# EAGLE design Board (EAGLE 9.5.1)
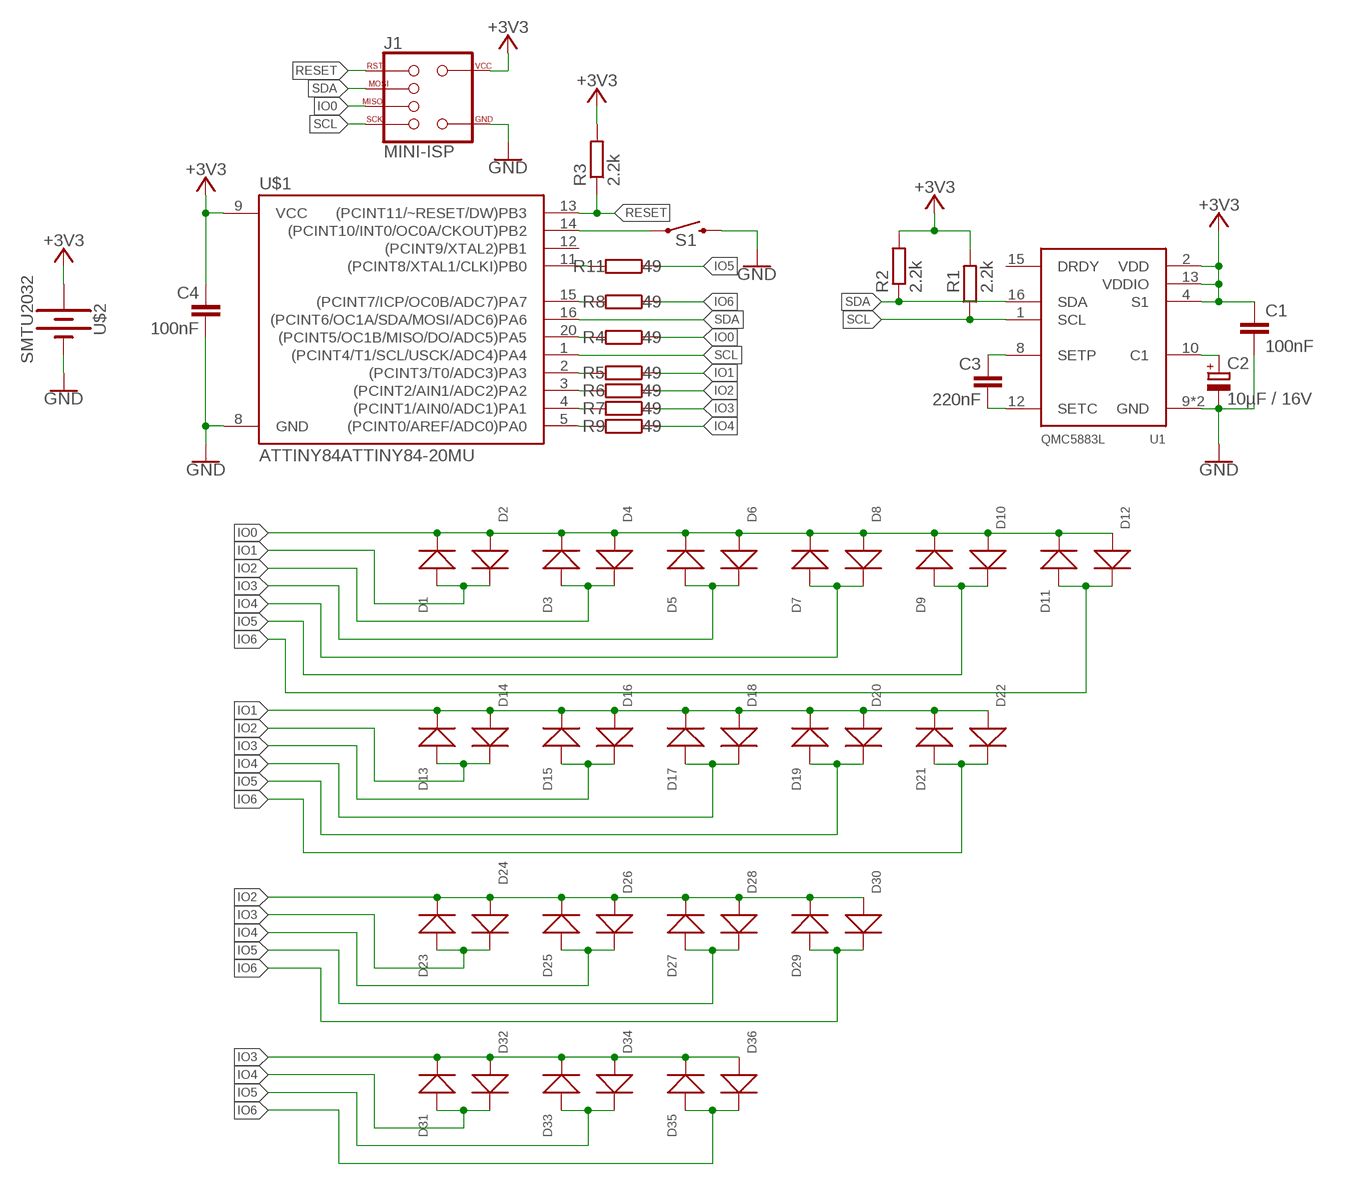
[diagram p0: schematic, sheet 1]

## Parts
C1  100nF  C-EUC0402K  [C0402K]
C2  10µF / 16V  CPOL-EUCT3216  [CT3216]
C3  220nF  C-EUC0402K  [C0402K]
C4  100nF  C-EUC0402K  [C0402K]
D1  RED  DIODE'0603'  [SOD-523]
D2  RED  DIODE'0603'  [SOD-523]
D3  RED  DIODE'0603'  [SOD-523]
D4  RED  DIODE'0603'  [SOD-523]
D5  RED  DIODE'0603'  [SOD-523]
D6  RED  DIODE'0603'  [SOD-523]
D7  RED  DIODE'0603'  [SOD-523]
D8  RED  DIODE'0603'  [SOD-523]
D9  YELLOW  DIODE'0603'  [SOD-523]
D10  RED  DIODE'0603'  [SOD-523]
D11  RED  DIODE'0603'  [SOD-523]
D12  RED  DIODE'0603'  [SOD-523]
D13  RED  DIODE'0603'  [SOD-523]
D14  RED  DIODE'0603'  [SOD-523]
D15  RED  DIODE'0603'  [SOD-523]
D16  RED  DIODE'0603'  [SOD-523]
D17  RED  DIODE'0603'  [SOD-523]
D18  YELLOW  DIODE'0603'  [SOD-523]
D19  RED  DIODE'0603'  [SOD-523]
D20  RED  DIODE'0603'  [SOD-523]
D21  RED  DIODE'0603'  [SOD-523]
D22  RED  DIODE'0603'  [SOD-523]
D23  RED  DIODE'0603'  [SOD-523]
D24  RED  DIODE'0603'  [SOD-523]
D25  RED  DIODE'0603'  [SOD-523]
D26  RED  DIODE'0603'  [SOD-523]
D27  YELLOW  DIODE'0603'  [SOD-523]
D28  RED  DIODE'0603'  [SOD-523]
D29  RED  DIODE'0603'  [SOD-523]
D30  RED  DIODE'0603'  [SOD-523]
D31  RED  DIODE'0603'  [SOD-523]
D32  RED  DIODE'0603'  [SOD-523]
D33  RED  DIODE'0603'  [SOD-523]
D34  RED  DIODE'0603'  [SOD-523]
D35  RED  DIODE'0603'  [SOD-523]
D36  YELLOW  DIODE'0603'  [SOD-523]
J1  MINI-ISP  [MINI-ISP]
R1  2.2k  R-EU_R0402  [R0402]
R2  2.2k  R-EU_R0402  [R0402]
R3  2.2k  R-EU_R0402  [R0402]
R4  49  R-EU_R0402  [R0402]
R5  49  R-EU_R0402  [R0402]
R6  49  R-EU_R0402  [R0402]
R7  49  R-EU_R0402  [R0402]
R8  49  R-EU_R0402  [R0402]
R9  49  R-EU_R0402  [R0402]
R11  49  R-EU_R0402  [R0402]
S1  MOMENTARY-SWITCH-SPST-SMD-5.2MM  [TACTILE_SWITCH_SMD_5.2MM]
U1  QMC5883L  [QFN50P300X300X102-16N]
U$1  ATTINY84ATTINY84-20MU  [QFN20]
U$2  SMTU2032  [SMTU2032]

## Nets
+3V3: C1.1 C4.1 J1.VDD R1.2 R2.2 R3.2 U1.2(VDD) U1.4(S1) U1.13(VDDIO) U$1.9(VCC) U$2.POS(+)
GND: C1.2 C2.- C4.2 J1.GND S1.3 U1.9(GND) U1.11(GND) U$1.8(GND) U$2.NEG(-)
IO0: D1.- D2.+ D3.- D4.+ D5.- D6.+ D7.- D8.+ D9.- D10.+ D11.- D12.+ J1.MISO R4.1
IO1: D1.+ D2.- D13.- D14.+ D15.- D16.+ D17.- D18.+ D19.- D20.+ D21.- D22.+ R5.1
IO2: D3.+ D4.- D13.+ D14.- D23.- D24.+ D25.- D26.+ D27.- D28.+ D29.- D30.+ R6.1
IO3: D5.+ D6.- D15.+ D16.- D23.+ D24.- D31.- D32.+ D33.- D34.+ D35.- D36.+ R7.1
IO4: D7.+ D8.- D17.+ D18.- D25.+ D26.- D31.+ D32.- R9.1
IO5: D9.+ D10.- D19.+ D20.- D27.+ D28.- D33.+ D34.- R11.1
IO6: D11.+ D12.- D21.+ D22.- D29.+ D30.- D35.+ D36.- R8.1
N$1: C2.+ U1.10(C1)
N$2: C3.1 U1.8(SETP)
N$3: C3.2 U1.12(SETC)
N$4: R11.2 U$1.11((PCINT8/XTAL1/CLKI)PB0)
N$5: R8.2 U$1.15((PCINT7/ICP/OC0B/ADC7)PA7)
N$6: R4.2 U$1.20((PCINT5/OC1B/MISO/DO/ADC5)PA5)
N$7: S1.1 U$1.14((PCINT10/INT0/OC0A/CKOUT)PB2)
N$8: R5.2 U$1.2((PCINT3/T0/ADC3)PA3)
N$9: R6.2 U$1.3((PCINT2/AIN1/ADC2)PA2)
N$10: R7.2 U$1.4((PCINT1/AIN0/ADC1)PA1)
N$11: R9.2 U$1.5((PCINT0/AREF/ADC0)PA0)
RESET: J1.RESET R3.1 U$1.13((PCINT11/~RESET/DW)PB3)
SCL: J1.SCK R1.1 U1.1(SCL) U$1.1((PCINT4/T1/SCL/USCK/ADC4)PA4)
SDA: J1.MOSI R2.1 U1.16(SDA) U$1.16((PCINT6/OC1A/SDA/MOSI/ADC6)PA6)
Unconnected: U1.15(DRDY) U$1.12((PCINT9/XTAL2)PB1)

## Library data of the parts
C1 C4 = rcl:C-EU: CAPACITOR, European symbol; JLC: CL05B104KO5NNNC; LCSC: C1525; SPICEPREFIX: C
C2 = rcl:CPOL-EU: POLARIZED CAPACITOR, European symbol; JLC: TAJA106K016RNJ; LCSC: C7171; SPICEPREFIX: C
C3 = rcl:C-EU: CAPACITOR, European symbol; JLC: CL05B224KO5NNNC; LCSC: C16772; SPICEPREFIX: C
D1-D36 = Seeed-OPL-Diode:DIODE*
J1 = MiniISP:MINI-ISP
R1-R3 = rcl:R-EU_: RESISTOR, European symbol; JLC: 0402WGF2201TCE; LCSC: C25879; SPICEPREFIX: R
R4-R9 R11 = rcl:R-EU_: RESISTOR, European symbol; JLC: 0603WAF470JT5E; LCSC: C23182; SPICEPREFIX: R
S1 = SparkFun-Switches:MOMENTARY-SWITCH-SPST: Momentary Switch (Pushbutton) - SPST Normally-open (NO) SPST momentary switches (buttons, pushbuttons). Variants PTH-12MM - 12mm square, through-hole Momentary Pushbutton Switch - 12mm Square <https://www.sparkfun.com/products/9190> (COM-09190) PTH-6.0MM, PTH-6.0MM-KIT - 6.0mm square, through-hole Mini Pushbutton Switch <https://www.sparkfun.com/products/97> (COM-00097) KIT package intended for soldering kit's - only one side of pads' copper is exposed. PTH-RIGHT-ANGLE-KIT - Right-angle, through-hole Right Angle Tactile Button <https://www.sparkfun.com/products/10791> - Used on SparkFun BigTime Watch Kit <https://www.sparkfun.com/products/11734> SMD-12MM - 12mm square, surface-mount Tactile Button - SMD (12mm) <https://www.sparkfun.com/products/12993> (COM-12993) Used on SparkFun PicoBoard <https://www.sparkfun.com/products/11888> SMD-4.5MM - 4.5mm Square Trackball Switch Used on SparkFun Blackberry Trackballer Breakout <https://www.sparkfun.com/products/13169> SMD-4.6MMX2.8MM - 4.60mm x 2.80mm, surface mount Used on SparkFun SAMD21 Mini Breakout <https://www.sparkfun.com/products/13664> SMD-5.2MM, SMD-5.2-REDUNDANT - 5.2mm square, surface-mount Mini Pushbutton Switch - SMD <https://www.sparkfun.com/products/8720> (COM-08720) Used on Arduino Pro Mini <https://www.sparkfun.com/products/11114> REDUNDANT package connects both switch circuits together SMD-6.0X3.5MM - 6.0 x 3.5mm, surface mount Momentary Reset Switch SMD <https://www.sparkfun.com/products/8229> (COM-08229) SMD-6.2MM-TALL - 6.2mm square, surface mount Tactile Button - SMD (6mm) <https://www.sparkfun.com/products/12992> Used on SparkFun Digital Sandbox <https://www.sparkfun.com/products/12651> SMD-RIGHT-ANGLE - Right-angle, surface mount Used on SparkFun Block for Intel® Edison - Arduino <https://www.sparkfun.com/products/13036>; JLC: TS-1187A-C-D-B; LCSC: C318888; PROD_ID: SWCH-08247; SF_SKU: COM-08720
U1 = PocketCompass:QMC5883L; JLC: QMC5883L-TR; LCSC: C192585
U$1 = SparkFun-IC-Microcontroller:ATTINY84: Atmel 14-pin 2/4/8kB flash uC Datasheet <https://cdn.sparkfun.com/datasheets/Widgets/doc8006.pdf> SparkFun Products Tiny AVR Programmer <https://www.sparkfun.com/products/11801> (PGM-11801) SparkFun Servo Trigger - Continuous Rotation <https://www.sparkfun.com/products/13872> (WIG-13872) SparkFun Servo Trigger <https://www.sparkfun.com/products/13118> (WIG-13118); JLC: ATTINY44A-MU; LCSC: C123718
U$2 = Parts:SMTU2032

## Board
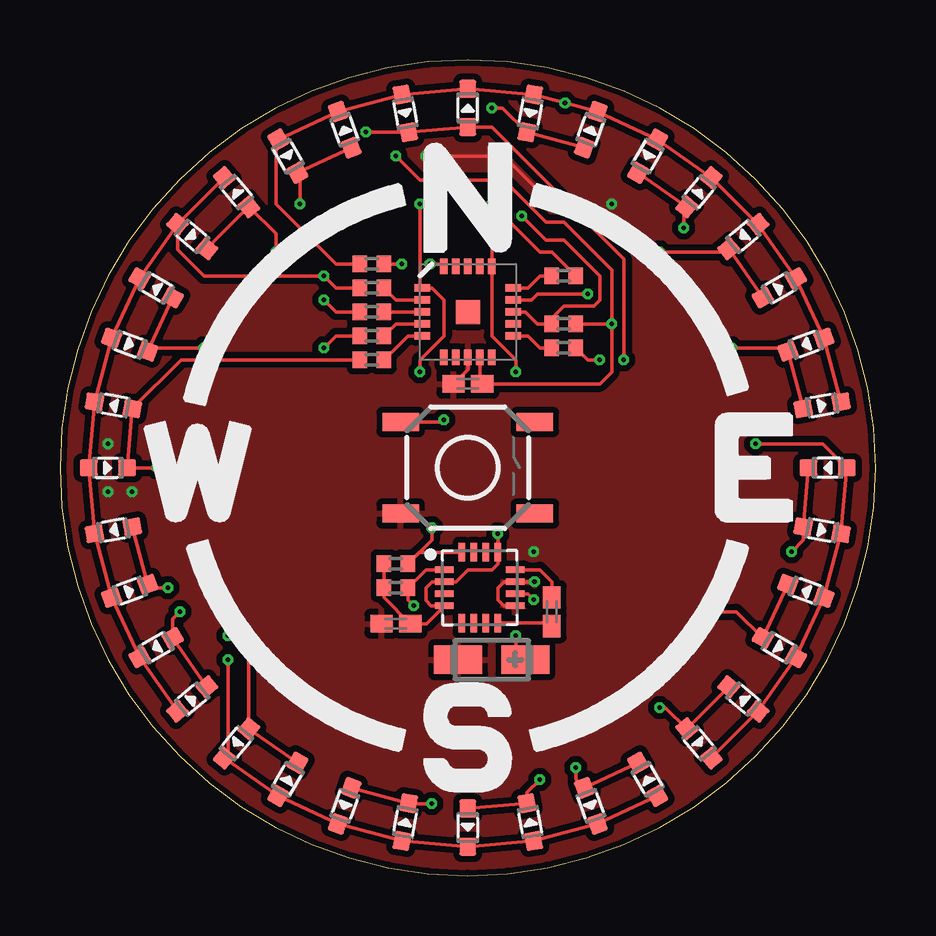
[diagram p1: board, top side]
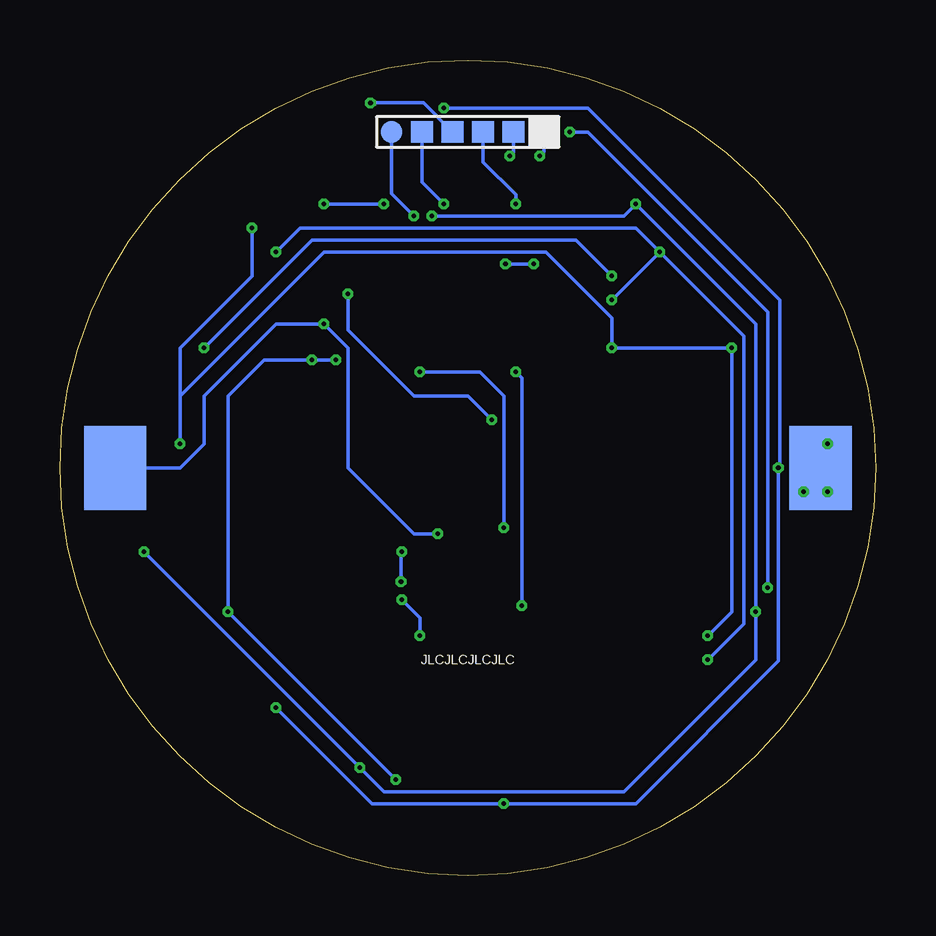
[diagram p2: board, bottom side, seen from below]

Size 34 x 34 mm. Coordinates in mm from the lower left corner, seen from the top.
Outline: 0,17 arc180 34,17 arc180 0,17
Copper layers (1*16): Top 0.035mm / dielectric 1.5mm / Bottom 0.035mm
Design rules "JLCPCB-Tented *": minimum track width 3.5mil, minimum drill 0.2mm, track to track 3.5mil, track to pad 5mil, pad to pad 6mil, via to via 6mil, smd to smd 3.5mil, copper to edge 0.2mm, drill to drill 5mil, minimum pad ring 3mil, minimum via ring 3mil, stop-mask expansion 4mil, vias tented up to drill 0.5mm, thermal gap 10mil
tRestrict: area 16.5,11.2 to 18,12.5

### Footprints (pad centres in the part's own frame; a part is rotated, then mirrored left to right if it is on the bottom)
C0402K = smd 0.925 x 0.74: 1 -0.6,0; 2 0.6,0
CT3216 = smd 2 x 1.2: + -1.4,0; - 1.4,0
SOD-523 = smd 0.762 x 0.7: + -0.8,0; - 0.8,0
MINI-ISP = smd 0.9 x 0.9: GND 1.905,0; MISO -0.635,0; MOSI -1.905,0; RESET -3.175,0; SCK 0.635,0; VDD 3.175,0
R0402 = smd 0.6 x 0.7: 1 -0.5,0; 2 0.5,0
TACTILE_SWITCH_SMD_5.2MM = smd 1.524 x 0.762: 1 -2.794,1.905; 2 2.794,1.905; 3 -2.794,-1.905; 4 2.794,-1.905
QFN50P300X300X102-16N = smd 0.773 x 0.27: 1 -1.478,0.75; 2 -1.478,0.25; 3 -1.478,-0.25; 4 -1.478,-0.75; 9 1.478,-0.75; 10 1.478,-0.25; 11 1.478,0.25; 12 1.478,0.75 | smd 0.27 x 0.773: 5 -0.75,-1.478; 6 -0.25,-1.478; 7 0.25,-1.478; 8 0.75,-1.478; 13 0.75,1.478; 14 0.25,1.478; 15 -0.25,1.478; 16 -0.75,1.478
QFN20 = smd 1 x 1: 0 0,0 | smd 0.65 x 0.3: 1 -1.9,1; 2 -1.9,0.5; 3 -1.9,0; 4 -1.9,-0.5; 5 -1.9,-1; 11 1.9,-1; 12 1.9,-0.5; 13 1.9,0; 14 1.9,0.5; 15 1.9,1 | smd 0.3 x 0.65: 6 -1,-1.9; 7 -0.5,-1.9; 8 0,-1.9; 9 0.5,-1.9; 10 1,-1.9; 16 1,1.9; 17 0.5,1.9; 18 0,1.9; 19 -0.5,1.9; 20 -1,1.9
SMTU2032 = smd 2.6 x 3.5: NEG 14.7,0; POS -14.7,0

### Placement (x,y rotation side)
C1  14,10.5 180 top
C2  18,9 180 top
C3  20.5,11 90 top
C4  17,20.5 180 top
D1  31.77,19.6 10 top
D2  31.1,22.13 200 top
D3  29.99,24.5 30 top
D4  28.49,26.64 220 top
D5  26.64,28.49 50 top
D6  24.5,29.99 240 top
D7  22.13,31.1 70 top
D8  19.6,31.77 260 top
D9  17,32 90 top
D10  14.4,31.77 280 top
D11  11.87,31.1 110 top
D12  9.5,29.99 300 top
D13  7.36,28.49 130 top
D14  5.51,26.64 320 top
D15  4.01,24.5 150 top
D16  2.9,22.13 340 top
D17  2.23,19.6 170 top
D18  2,17 0 top
D19  2.23,14.4 190 top
D20  2.9,11.87 20 top
D21  4.01,9.5 210 top
D22  5.51,7.36 40 top
D23  7.36,5.51 230 top
D24  9.5,4.01 60 top
D25  11.87,2.9 250 top
D26  14.4,2.23 80 top
D27  17,2 270 top
D28  19.6,2.23 100 top
D29  22.13,2.9 290 top
D30  24.5,4.01 120 top
D31  26.64,5.51 310 top
D32  28.49,7.36 140 top
D33  29.99,9.5 330 top
D34  31.1,11.87 160 top
D35  31.77,14.4 350 top
D36  32,17 180 top
J1  17,31 0 bottom
R1  14,12 180 top
R2  14,13 180 top
R3  21,23 0 top
R4  13,25.5 0 top
R5  13,24.5 0 top
R6  13,23.5 0 top
R7  13,22.5 0 top
R8  21,25 180 top
R9  13,21.5 0 top
R11  21,22 180 top
S1  17,17 0 top
U1  17.5,12 0 top
U$1  17,23.5 0 top
U$2  17,17 0 bottom

### Tracks (layer width: path | path; a pad name or v marks a point on that pad's centre or on a via)
+3V3  (via drill 0.2 pad 0.45)
  Top 0.152: R2.2 R1.2 13.5,11.6 C1.1 15.27,10.5 U1.4 15.46,11.25 15.25,11.46 15.25,12 15.5,12.25 U1.2 16.5,12.25 17,12.75 18,12.75 18.25,13 U1.13 v18.25,14.25 | U$1.9 17.5,20.6 C4.1 22.5,20.5 23,21 v23,23 | v23,23 R3.2 | v14,30 15,29 18.5,29 20.25,27.25 21,27.25 23,25.25 v23,23
  Bottom 0.152: U$2.POS 29,17 28,18 28,20 25,23 v23,23 22,22 22,17 19.25,14.25 v18.25,14.25 | J1.VDD 13.82,30.18 v14,30
GND  (via drill 0.2 pad 0.45)
  Top 0.152: C4.2 17,21.1 U$1.8 | U1.9 18.5,11.25 18.25,11.5 18.25,12 18.5,12.25 U1.11 v19.78,12.25 | v20.5,28 18.5,30 v15.25,30
  Bottom 0.152: v19.78,12.25 19.78,13.47 v19.75,13.5 | v2,16 2,16.7 U$2.NEG 3,16.3 v3,16 | J1.GND 15.1,30.16 v15.25,30 | v20.5,28 v23,28
  other vias: 2,18
  pour Top (isolate 0.254): 0,0 0,34 34,34 34,0
IO0  (via drill 0.2 pad 0.45)
  Top 0.152: D1.- D2.+ D3.- D4.+ D5.- D6.+ D7.- v21.06,32.21 D8.+ D9.- D10.+ D11.- D12.+ 9,30.58 9,28 11.5,25.5 R4.1
  Bottom 0.152: J1.MISO 18.84,32.21 v21.06,32.21
IO1  (via drill 0.2 pad 0.45)
  Top 0.152: D1.+ D2.- 30.2,22 v28,22 | D22.+ D21.- D20.+ D19.- D18.+ D17.- D16.+ D15.- D14.+ | D14.+ D13.- | R5.1 11.5,24.5 v11,25 6,25 4.9,26.1 D14.+
  Bottom 0.152: v11,25 12.5,26.5 23.5,26.5 v28,22
IO2  (via drill 0.2 pad 0.45)
  Top 0.152: D3.+ D4.- 27.75,26 v25,26 | D30.+ D29.- D28.+ D27.- D26.+ D25.- D24.+ D23.- 7,5.05 v7,9 | D14.- D13.+ 9,26.75 v9,26 | R6.1 11.5,23.5 v11,24
  Bottom 0.152: v11,24 v9,26 | v7,9 5.5,10.5 5.5,22.5 v9,26 | v25,26 24,27 10,27 v9,26
IO3  (via drill 0.2 pad 0.45)
  Top 0.152: D6.- 25.98,27.98 | 25.98,27.98 D5.+ | D31.- D32.+ D33.- D34.+ D35.- D36.+ 31.8,18 v29,18 | D16.- 3.77,22.11 | 3.77,22.11 D15.+ | D24.- D23.+ 7.87,9.13 v7,10 | v6,22 3.88,22 3.77,22.11 | v26,27 26,27.96 25.98,27.98 | R7.1 11.5,22.5 v11,22
  Bottom 0.152: v7,10 6,11 v6,22 v11,22 11,23.25 13.75,26 23,26 29,20 | v29,18 29,20 | v26,27 26,25 29,22 29,20
IO4  (via drill 0.2 pad 0.45)
  Top 0.152: D7.+ D8.- 18.45,32 v18,32 | D32.- D31.+ 25.25,7 v25,7 | D25.+ D26.- 14.55,3 v15.5,3 | R9.1 5.05,21.5 D17.+ D18.- v4.05,17
  Bottom 0.152: v18,32 12,32 4,24 4,17.05 v4.05,17 4.05,8.95 10,3 v15.5,3 21,3 v25,7
IO5  (via drill 0.2 pad 0.45)
  Top 0.152: D34.- D33.+ 28.2,11 v27,11 | D27.+ 17.02,2.8 D28.- 19.47,3.47 v20,4 | D19.+ D20.- 3.8,12 v4.5,12 | v12.75,31 14.52,31 D10.- 15.99,31.11 D9.+ 18,31.2 23.5,25.7 v23.5,21.5 | v22.5,21.5 22,21.5 R11.1
  Bottom 0.152: v4.5,12 4.5,23.5 12,31 v12.75,31 | v20,4 v27,11 27,20 25.5,21.5 v23.5,21.5 v22.5,21.5
IO6  (via drill 0.2 pad 0.45)
  Top 0.152: D11.+ 11.89,30.23 D12.- 10,29.2 v10,28 | D36.- D35.+ 30.98,13.98 v30.5,13.5 | D30.- D29.+ 21.5,4.01 v21.5,4.5 | D22.- D21.+ 4.7,10.7 v5,11 | R8.1 20.5,26 20,26 v18.5,27.5
  Bottom 0.152: v30.5,13.5 v21.5,4.5 20.5,3.5 10.5,3.5 5,9 v5,11 5,23 v10,28 10.5,27.5 v18.5,27.5
N$1  (via drill 0.2 pad 0.45)
  Top 0.152: C2.+ 19,9.4 v19,10 | U1.10 19.5,11.75 v19.75,11.5
  Bottom 0.152: v19,10 19,10.75 v19.75,11.5
N$2
  Top 0.152: U1.8 20.38,10.52 C3.1
N$3
  Top 0.152: U1.12 20,12.75 20.5,12.25 C3.2
N$4
  Top 0.152: R11.2 20,22 19.5,22.5 U$1.11
N$5
  Top 0.152: R8.2 20,25 19.5,24.5 U$1.15
N$6  (via drill 0.2 pad 0.45)
  Top 0.152: R4.2 v14.25,25.5 | v15.43,25.5 15.9,25.5 U$1.20
  Bottom 0.152: v14.25,25.5 v15.43,25.5
N$7  (via drill 0.2 pad 0.45)
  Top 0.152: v22,24.25 19.9,24.25 19.65,24 U$1.14 | v16,19 15.9,18.91 S1.1
  Bottom 0.152: v22,24.25 22,22.75 19.25,20 17,20 v16,19
N$8
  Top 0.152: R5.2 14,24 U$1.2
N$9
  Top 0.152: R6.2 U$1.3
N$10
  Top 0.152: R7.2 14,23 U$1.4
N$11
  Top 0.152: U$1.5 14.5,22.5 R9.2
RESET  (via drill 0.2 pad 0.45)
  Top 0.152: U$1.13 19.4,23.5 19.9,23 R3.1 20.5,23.25 21,23.75 22.25,23.75 22.5,24 22.5,25 21,26.5 20.25,26.5 v19.25,27.5
  Bottom 0.152: J1.RESET 20.18,28.43 v19.25,27.5
SCL  (via drill 0.2 pad 0.45)
  Top 0.152: v15,21 15,21.5 16,22.5 16,24 15.5,24.5 U$1.1 15,24.6 v15,28 | v14.75,11.25 14.5,11.5 R1.1 15.25,12.75 U1.1
  Bottom 0.152: v15,21 14.75,20.75 v14.75,11.25 | J1.SCK 16.36,29.75 15,28.39 v15,28
SDA  (via drill 0.2 pad 0.45)
  Top 0.152: v19,21 19,21.5 18,22.5 U$1.16 v18,28 | v15.5,14.5 15.5,14 R2.1 14.98,13.48 U1.16
  Bottom 0.152: v19,21 16.5,21 15.5,20 v15.5,14.5 | J1.MOSI 18.91,28.91 v18,28

### Text on the board
bPlace: JLCJLCJLCJLC